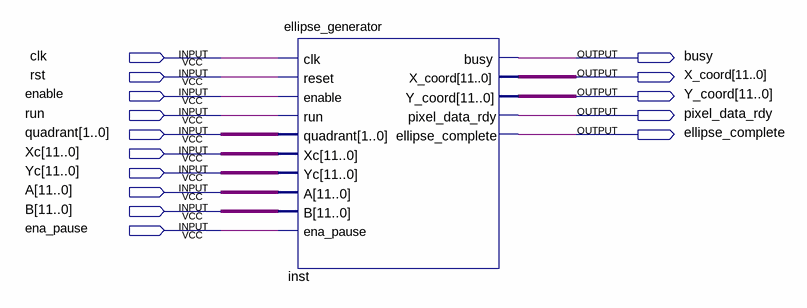
[diagram p0: schematic sheet]
// Quartus schematic geo.bdf as structural Verilog: 1 symbols, 15 pins
module geo (
  input  clk,
  input  rst,
  input  enable,
  input  run,
  input  [1:0] quadrant,
  input  [11:0] Xc,
  input  [11:0] Yc,
  input  [11:0] A,
  input  [11:0] B,
  input  ena_pause,
  output busy,
  output [11:0] X_coord,
  output [11:0] Y_coord,
  output pixel_data_rdy,
  output ellipse_complete
);

  ellipse_generator inst (
    .clk(clk), .reset(rst), .enable(enable), .run(run), .quadrant(quadrant), .Xc(Xc), .Yc(Yc), .A(A), .B(B),
    .ena_pause(ena_pause), .busy(busy), .X_coord(X_coord), .Y_coord(Y_coord),
    .pixel_data_rdy(pixel_data_rdy), .ellipse_complete(ellipse_complete));
endmodule
